# Altium schematic sheet Audio_Input_Line_In.SchDoc: Audio Research: Line In
size A4; DrawnBy: Connor Dack; Engineer: Connor Dack; DocumentNumber: 12; Revision: 1.0; SheetNumber: 12; SheetTotal: 20
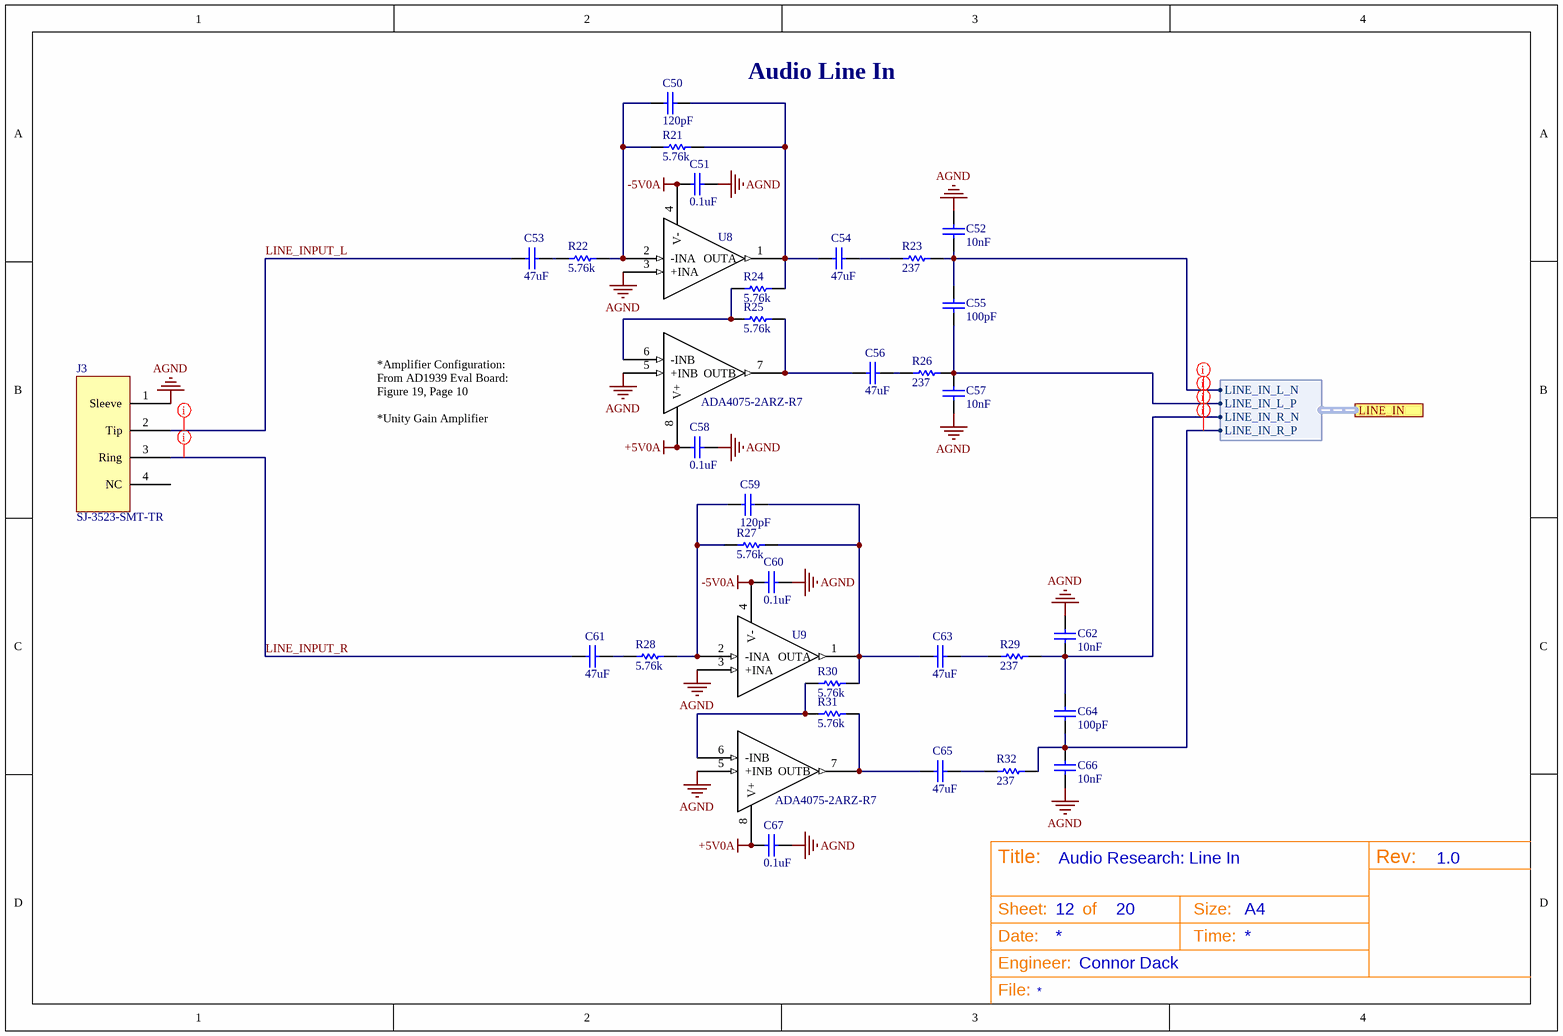
[diagram p0: Audio_Input_Line_In.SchDoc]

## Parts
C50  Capacitance: 120pF  [3-0603_L]  (hidden comment: CL10C121JB8NCNC)
C51  Capacitance: 0.1uF  [3-0603_L]  (hidden comment: CL10F104ZO8NNNC)
C52  Capacitance: 10nF  [3-0603_L]
C53  Capacitance: 47uF  [C1210X25_L]  (hidden comment: CL32A476KOJNNNE)
C54  Capacitance: 47uF  [C1210X25_L]  (hidden comment: CL32A476KOJNNNE)
C55  Capacitance: 100pF  [3-0603_L]  (hidden comment: C1608C0G2A101J)
C56  Capacitance: 47uF  [C1210X25_L]  (hidden comment: CL32A476KOJNNNE)
C57  Capacitance: 10nF  [3-0603_L]
C58  Capacitance: 0.1uF  [3-0603_L]  (hidden comment: CL10F104ZO8NNNC)
C59  Capacitance: 120pF  [3-0603_L]  (hidden comment: CL10C121JB8NCNC)
C60  Capacitance: 0.1uF  [3-0603_L]  (hidden comment: CL10F104ZO8NNNC)
C61  Capacitance: 47uF  [C1210X25_L]  (hidden comment: CL32A476KOJNNNE)
C62  Capacitance: 10nF  [3-0603_L]
C63  Capacitance: 47uF  [C1210X25_L]  (hidden comment: CL32A476KOJNNNE)
C64  Capacitance: 100pF  [3-0603_L]  (hidden comment: C1608C0G2A101J)
C65  Capacitance: 47uF  [C1210X25_L]  (hidden comment: CL32A476KOJNNNE)
C66  Capacitance: 10nF  [3-0603_L]
C67  Capacitance: 0.1uF  [3-0603_L]  (hidden comment: CL10F104ZO8NNNC)
J3  SJ-3523-SMT-TR  [SJ-3523-SMT-TR]
R21  Resistance (Ohms): 5.76k  [3-0603_R_L]  (hidden comment: ERJ-3EKF5761V)
R22  Resistance (Ohms): 5.76k  [3-0603_R_L]  (hidden comment: ERJ-3EKF5761V)
R23  Resistance (Ohms): 237  [3-0603_R_L]  (hidden comment: ERJ-3EKF2370V)
R24  Resistance (Ohms): 5.76k  [3-0603_R_L]  (hidden comment: ERJ-3EKF5761V)
R25  Resistance (Ohms): 5.76k  [3-0603_R_L]  (hidden comment: ERJ-3EKF5761V)
R26  Resistance (Ohms): 237  [3-0603_R_L]  (hidden comment: ERJ-3EKF2370V)
R27  Resistance (Ohms): 5.76k  [3-0603_R_L]  (hidden comment: ERJ-3EKF5761V)
R28  Resistance (Ohms): 5.76k  [3-0603_R_L]  (hidden comment: ERJ-3EKF5761V)
R29  Resistance (Ohms): 237  [3-0603_R_L]  (hidden comment: ERJ-3EKF2370V)
R30  Resistance (Ohms): 5.76k  [3-0603_R_L]  (hidden comment: ERJ-3EKF5761V)
R31  Resistance (Ohms): 5.76k  [3-0603_R_L]  (hidden comment: ERJ-3EKF5761V)
R32  Resistance (Ohms): 237  [3-0603_R_L]  (hidden comment: ERJ-3EKF2370V)
U8  ADA4075-2ARZ-R7  [SOIC127P600X175-8L]
U9  ADA4075-2ARZ-R7  [SOIC127P600X175-8L]

## Ports
LINE_IN (harness LINE_IN)

## Harnesses
LINE_IN: LINE_IN_R_P, LINE_IN_R_N, LINE_IN_L_N, LINE_IN_L_P

## Nets
+5V0A: C58.2 C67.2 U8.8(V+) U9.8(V+)
-5V0A: C51.2 C60.2 U8.4(V-) U9.4(V-)
AGND: C51.1 C52.2 C57.1 C58.1 C60.1 C62.2 C66.1 C67.1 J3.1(Sleeve) U8.3(+INA) U8.5(+INB) U9.3(+INA) U9.5(+INB)
LINE_INPUT_L: C53.1 J3.2(Tip)
LINE_INPUT_R: C61.1 J3.3(Ring)
NetC50_1: C50.1 R21.1 R22.2 U8.2(-INA)
NetC50_2: C50.2 C54.1 R21.2 R24.1 U8.1(OUTA)
NetC52_1: C52.1 C55.2 R23.2 ; port LINE_IN.LINE_IN_L_N
NetC53_2: C53.2 R22.1
NetC54_2: C54.2 R23.1
NetC55_1: C55.1 C57.2 R26.2 ; port LINE_IN.LINE_IN_L_P
NetC56_1: C56.1 R25.2 U8.7(OUTB)
NetC56_2: C56.2 R26.1
NetC59_1: C59.1 R27.1 R28.2 U9.2(-INA)
NetC59_2: C59.2 C63.1 R27.2 R30.2 U9.1(OUTA)
NetC61_2: C61.2 R28.1
NetC62_1: C62.1 C64.2 R29.2 ; port LINE_IN.LINE_IN_R_N
NetC63_2: C63.2 R29.1
NetC64_1: C64.1 C66.2 R32.2 ; port LINE_IN.LINE_IN_R_P
NetC65_1: C65.1 R31.2 U9.7(OUTB)
NetC65_2: C65.2 R32.1
NetR24_2: R24.2 R25.1 U8.6(-INB)
NetR30_1: R30.1 R31.1 U9.6(-INB)

Not connected (* = marked no-connect by the designer): J3 4(NC)

## Layout directives
net class Line_In: NetC52_1, NetC55_1, NetC62_1, NetC64_1
net class Line_In_3.5mm: LINE_INPUT_L, LINE_INPUT_R

## Notes on the sheet
- Audio Line In
- *Amplifier Configuration: From AD1939 Eval Board: Figure 19, Page 10
  *Unity Gain Amplifier
- Title:
- Sheet:
- of
- Size:
- A4
- Rev:
- Date:
- Engineer:
- Time:
- File:

## Library data of the parts
C50 C59 = CL10C121JB8NCNC: 120pF 50V Ceramic Capacitor C0G, NP0 0603 (1608 Metric) 0.063" L x 0.031" W (1.60mm x 0.80mm); Manufacturer: Samsung Electro-Mechanics America, Inc.; Tolerance: ±5%; Supplier 1: Digi-Key; Manufacturer Part Number: CL10C121JB8NCNC; RoHS: RoHS Compliant; Category: Capacitors; Stock 1: 26285; Pricing 1: 1=0.1, 10=0.03, 25=0.0208, 50=0.016, 100=0.0135, 500=0.00948, 1000=0.00738 (USD); Packaging: Cut Tape (CT); Part Status: Active; Voltage - Rated: 50V; Temperature Coefficient: C0G, NP0; Mounting Type: Surface Mount, MLCC; Operating Temperature: -55°C ~ 125°C; Applications: General Purpose; Ratings: -; Package / Case: 0603 (1608 Metric); Size / Dimension: 0.063" L x 0.031" W (1.60mm x 0.80mm); Height - Seated (Max): -; Thickness (Max): 0.035" (0.90mm); Lead Spacing: -; Features: -; Lead Style: -; ComponentLink1URL: http://media.digikey.com/pdf/Data%20Sheets/Samsung%20PDFs/CL10C121JB8NCNC_Spec.pdf; ComponentLink1Description: http://media.digikey.com/pdf/Data%20Sheets/Samsung%20PDFs/CL10C121JB8NCNC_Spec.pdf; Supplier Part Number 1: 1276-2180-1-ND; Load Status: *
C51 C58 C60 C67 = CL10F104ZO8NNNC: CAP CER 0.1UF 16V Y5V 0603; Manufacturer: Samsung; Tolerance: 80%; Supplier 1: Digi-Key; Stock 1: 40000; Pricing 1: 1=0.1, 10=0.038, 100=0.0169, 500=0.01208, 1000=0.00949 (USD); Mount: Surface Mount; Case/Package: 0603; Case Code (Metric): 1608; Case Code (Imperial): 0603; Min Operating Temperature: -30°C; Max Operating Temperature: 85°C; Package Quantity: 1; Packaging: Tape and Reel; Voltage Rating: 16V; Dielectric: Y5V; Length: 1.6mm; Height: 0.8mm; Width: 0.031inch; Thickness: 0.035inch; Depth: 0.8mm; Radiation Hardening: No; ComponentLink1URL: https://datasheet.ciiva.com/25805/cl10f104zo8nnnc-25805810.pdf; ComponentLink1Description: https://datasheet.ciiva.com/25805/cl10f104zo8nnnc-25805810.pdf; ComponentLink2URL: https://datasheet.ciiva.com/16199/cl10f104zo8nnnc-16199254.pdf; ComponentLink2Description: https://datasheet.ciiva.com/16199/cl10f104zo8nnnc-16199254.pdf; Supplier Part Number 1: 1276-1258-6-ND; Manufacturer Part Number: CL10F104ZO8NNNC
C52 C57 C62 C66 = C1608C0G1H050C080AA: CAP CER 10000PF 200V X7R 0603; Manufacturer: KEMET; Dielectric Material: Ceramic; Tolerance: 5%; Supplier 1: Digi-Key; Manufacturer Part Number: C0603C103J2RACTU; Stock 1: 2052; Pricing 1: 1=0.57, 10=0.392, 100=0.2355, 500=0.1766, 1000=0.14913 (USD); Mount: Surface Mount; Case/Package: 0603; Case Code (Metric): 1608; Case Code (Imperial): 0603; Min Operating Temperature: -55°C; Max Operating Temperature: 125°C; Package Quantity: 1; Voltage Rating: 200V; Packaging: Tape and Reel; Voltage Rating (DC): 200V; Dielectric: X7R; Termination: SMD/SMT; Length: 1.6mm; Height: 0.8mm; Width: 0.031inch; Thickness: 0.034inch; ComponentLink1URL: https://search.kemet.com/component-edge/download/datasheet/C0603C103J2RACTU.pdf; ComponentLink1Description: https://search.kemet.com/component-edge/download/datasheet/C0603C103J2RACTU.pdf; ComponentLink2URL: http://www.kemet.com/Lists/ProductCatalog/Attachments/53/KEM_C1002_X7R_SMD.pdf; ComponentLink2Description: http://www.kemet.com/Lists/ProductCatalog/Attachments/53/KEM_C1002_X7R_SMD.pdf; Supplier Part Number 1: 399-10040-6-ND
C53 C54 C56 C61 C63 C65 = CL32A476KOJNNNE: CAP CER 47UF 16V X5R 1210; Manufacturer: Samsung; Tolerance: 10%; Supplier 1: Digi-Key; Manufacturer Part Number: CL32A476KOJNNNE; Stock 1: 10000; Pricing 1: 1=1.12, 10=0.853, 100=0.6104, 500=0.47254 (USD); Mount: Surface Mount; Case/Package: 1210; Case Code (Metric): 3225; Case Code (Imperial): 1210; Min Operating Temperature: -55°C; Max Operating Temperature: 85°C; Package Quantity: 1; Packaging: Tape and Reel; Voltage Rating: 16V; Dielectric: X5R; Voltage Rating (DC): 16V; Length: 0.126inch; Width: 0.098inch; Thickness: 0.106inch; Lead Free: Lead Free; ComponentLink1URL: https://datasheet.ciiva.com/25785/cl32a476kojnnne-25785873.pdf; ComponentLink1Description: https://datasheet.ciiva.com/25785/cl32a476kojnnne-25785873.pdf; Supplier Part Number 1: 1276-3376-6-ND
C55 C64 = C1608C0G2A101J: CAP CER 100PF 100V 5% NP0 0603; Manufacturer: TDK Corporation; Temperature Coefficient: C0G, NP0; Supplier 1: Digi-Key; Manufacturer Part Number: C1608C0G2A101J; RoHS: RoHS Compliant; Category: Capacitors; Stock 1: 128588; Pricing 1: 10=0.05, 100=0.0231, 250=0.01892, 500=0.01618, 1000=0.0126 (USD); Voltage - Rated: 100V; Tolerance: ±5%; Mounting Type: Surface Mount, MLCC; Operating Temperature: -55°C ~ 125°C; Applications: General Purpose; Ratings: -; Package / Case: 0603 (1608 Metric); Size / Dimension: 0.063" L x 0.031" W (1.60mm x 0.80mm); Height - Seated (Max): -; Thickness (Max): 0.037" (0.95mm); Lead Spacing: -; Features: -; Packaging: Cut Tape (CT); Lead Style: -; ComponentLink1URL: http://www.tdk.com/pdf/mid_volt_B11.pdf; ComponentLink1Description: http://www.tdk.com/pdf/mid_volt_B11.pdf; Supplier Part Number 1: 445-2306-1-ND; Load Status: *
J3 = SJ-3523-SMT-TR: 3.50mm (0.141", 1/8", Mini Plug) - Headphone Phone Jack Stereo Connector Solder; Manufacturer: CUI Inc.; Gender: Female; Actual Diameter: 0.142" (3.60mm); Number of Positions/Contacts: 3 Conductors, 3 Contacts; Internal Switch(s): Does Not Contain Switch; Shielding: Unshielded; Voltage - Rated: 12VDC; Current Rating: 1A; Mating Length/Depth: 0.551" (14.00mm); Body Color: Black; Includes: 1 pc - 1 Connector; Notes: FE Provides: 23; LatestRevisionDate: 17-Jul-2002; LatestRevisionNote: Re-released for DXP Platform.; Publisher: Altium Limited; Supplier 1: Digi-Key; RoHS: RoHS Compliant; Category: Connectors, Interconnects; Stock 1: 104981; Pricing 1: 1=1.34, 10=1.043, 100=0.7961, 500=0.63558 (USD); Packaging: Cut Tape (CT); Part Status: Active; Connector Type: Phone Jack; Signal Lines: Stereo; Industry Recognized Mating Diameter: 3.50mm (0.141", 1/8", Mini Plug) - Headphone; Mounting Type: Surface Mount, Right Angle; Termination: Solder; Features: Board Guide; Insulation Color: -; Contact Material - Plating: Silver; Body Material: -; ComponentLink1URL: http://www.cui.com/product/resource/digikeypdf/sj-352x-smt_series.pdf; ComponentLink1Description: http://www.cui.com/product/resource/digikeypdf/sj-352x-smt_series.pdf; Supplier Part Number 1: CP-3523SJCT-ND; Manufacturer Part Number: SJ-3523-SMT-TR
R21 R22 R24 R25 R27 R28 R30 R31 = ERJ-3EKF5761V: RES SMD 5.76K OHM 1% 1/10W 0603; Manufacturer: Panasonic Electronic Components; Power (Watts): 0.1W, 1/10W; Temperature Coefficient: ±100ppm/°C; Supplier 1: Digi-Key; Manufacturer Part Number: ERJ-3EKF5761V; RoHS: RoHS Compliant; Category: Resistors; Stock 1: 90842; Pricing 1: 1=0.1, 50=0.0114, 100=0.0084, 250=0.00644, 500=0.00514, 1000=0.00379 (USD); Packaging: Cut Tape (CT); Part Status: Active; Tolerance: ±1%; Composition: Thick Film; Features: Automotive AEC-Q200; Operating Temperature: -55°C ~ 155°C; Package / Case: 0603 (1608 Metric); Supplier Device Package: 0603; Size / Dimension: 0.063" L x 0.031" W (1.60mm x 0.80mm); Height: 0.022" (0.55mm); Number of Terminations: 2; ComponentLink1URL: http://industrial.panasonic.com/www-cgi/jvcr13pz.cgi?E+PZ+3+AOA0002+ERJ3EKF5761V+7+WW; ComponentLink1Description: http://industrial.panasonic.com/www-cgi/jvcr13pz.cgi?E+PZ+3+AOA0002+ERJ3EKF5761V+7+WW; Supplier Part Number 1: P5.76KHCT-ND; Load Status: *
R23 R26 R29 R32 = ERJ-3EKF2370V: RES SMD 237 OHM 1% 1/10W 0603; Manufacturer: Panasonic Electronic Components; Power (Watts): 0.1W, 1/10W; Temperature Coefficient: ±100ppm/°C; Supplier 1: Digi-Key; Manufacturer Part Number: ERJ-3EKF2370V; RoHS: RoHS Compliant; Category: Resistors; Stock 1: 74413; Pricing 1: 1=0.1, 50=0.0114, 100=0.0084, 250=0.00644, 500=0.00514, 1000=0.00379 (USD); Packaging: Cut Tape (CT); Part Status: Active; Tolerance: ±1%; Composition: Thick Film; Features: Automotive AEC-Q200; Operating Temperature: -55°C ~ 155°C; Package / Case: 0603 (1608 Metric); Supplier Device Package: 0603; Size / Dimension: 0.063" L x 0.031" W (1.60mm x 0.80mm); Height: 0.022" (0.55mm); Number of Terminations: 2; ComponentLink1URL: http://industrial.panasonic.com/www-cgi/jvcr13pz.cgi?E+PZ+3+AOA0002+ERJ3EKF2370V+7+WW; ComponentLink1Description: http://industrial.panasonic.com/www-cgi/jvcr13pz.cgi?E+PZ+3+AOA0002+ERJ3EKF2370V+7+WW; Supplier Part Number 1: P237HCT-ND; Load Status: *
U8 U9 = ADA4075-2ARZ-R7: IC OPAMP GP 6.5MHZ 8SOIC; Manufacturer: Analog Devices Inc.; Amplifier Type: General Purpose; Number of Circuits: 2; Slew Rate: 12 V/µs; Current - Input Bias: 30nA; Voltage - Input Offset: 200µV; Current - Supply: 1.8mA; Current - Output / Channel: 40mA; Voltage - Supply, Single/Dual (±): ±4.5 V ~ 18 V; Supplier 1: Digi-Key; RoHS: RoHS Compliant; Category: Integrated Circuits (ICs); Stock 1: 11196; Pricing 1: 1=2.28, 10=2.05, 100=1.6441, 500=1.35136 (USD); Packaging: Cut Tape (CT); Part Status: Active; Output Type: -; Gain Bandwidth Product: 6.5MHz; -3db Bandwidth: -; Operating Temperature: -40°C ~ 125°C; Mounting Type: Surface Mount; Package / Case: 8-SOIC (0.154", 3.90mm Width); Supplier Device Package: 8-SOIC; ComponentLink1URL: http://www.analog.com/media/en/technical-documentation/data-sheets/ADA4075-2.pdf; ComponentLink1Description: http://www.analog.com/media/en/technical-documentation/data-sheets/ADA4075-2.pdf; Supplier Part Number 1: ADA4075-2ARZ-R7CT-ND; Manufacturer Part Number: ADA4075-2ARZ-R7